# EAGLE schematic tr_1 (EAGLE 7.4.0)
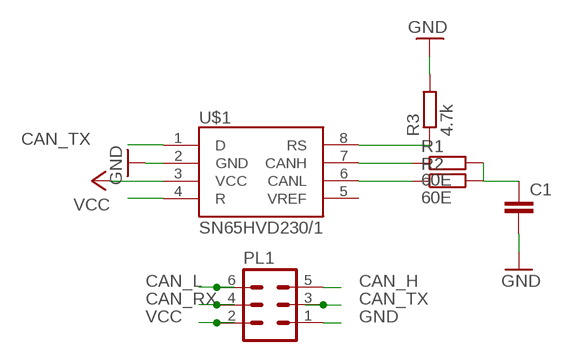
[diagram p0: schematic, sheet 1]

## Parts
C1  C-EUC0805K  [C0805K]
PL1  06V  [06V]
R1  60E  R-EU_R0805W  [R0805W]
R2  60E  R-EU_R0805W  [R0805W]
R3  4.7k  R-EU_R0805W  [R0805W]
U$1  SN65HVD230/1  [SO8]

## Nets
CAN_H: PL1.5 R1.1 U$1.7(CANH)
CAN_L: PL1.6 R2.1 U$1.6(CANL)
CAN_RX: PL1.4 U$1.4(R)
CAN_TX: PL1.3 U$1.1(D)
GND: C1.2 PL1.1 R3.2 U$1.2(GND)
N$1: R3.1 U$1.8(RS)
N$4: C1.1 R1.2 R2.2
VCC: PL1.2 U$1.3(VCC)
Unconnected: U$1.5(VREF)

## Library data of the parts
C1 = rcl:C-EU: CAPACITOR, European symbol
PL1 = con-harting-v:06V: CONNECTOR; OC_FARNELL: unknown; OC_NEWARK: unknown
R1-R3 = resistor:R-EU_: RESISTOR, European symbol
U$1 = texas_1:SN65HVD230/1